# Altium project PCB_Project.PrjPCB
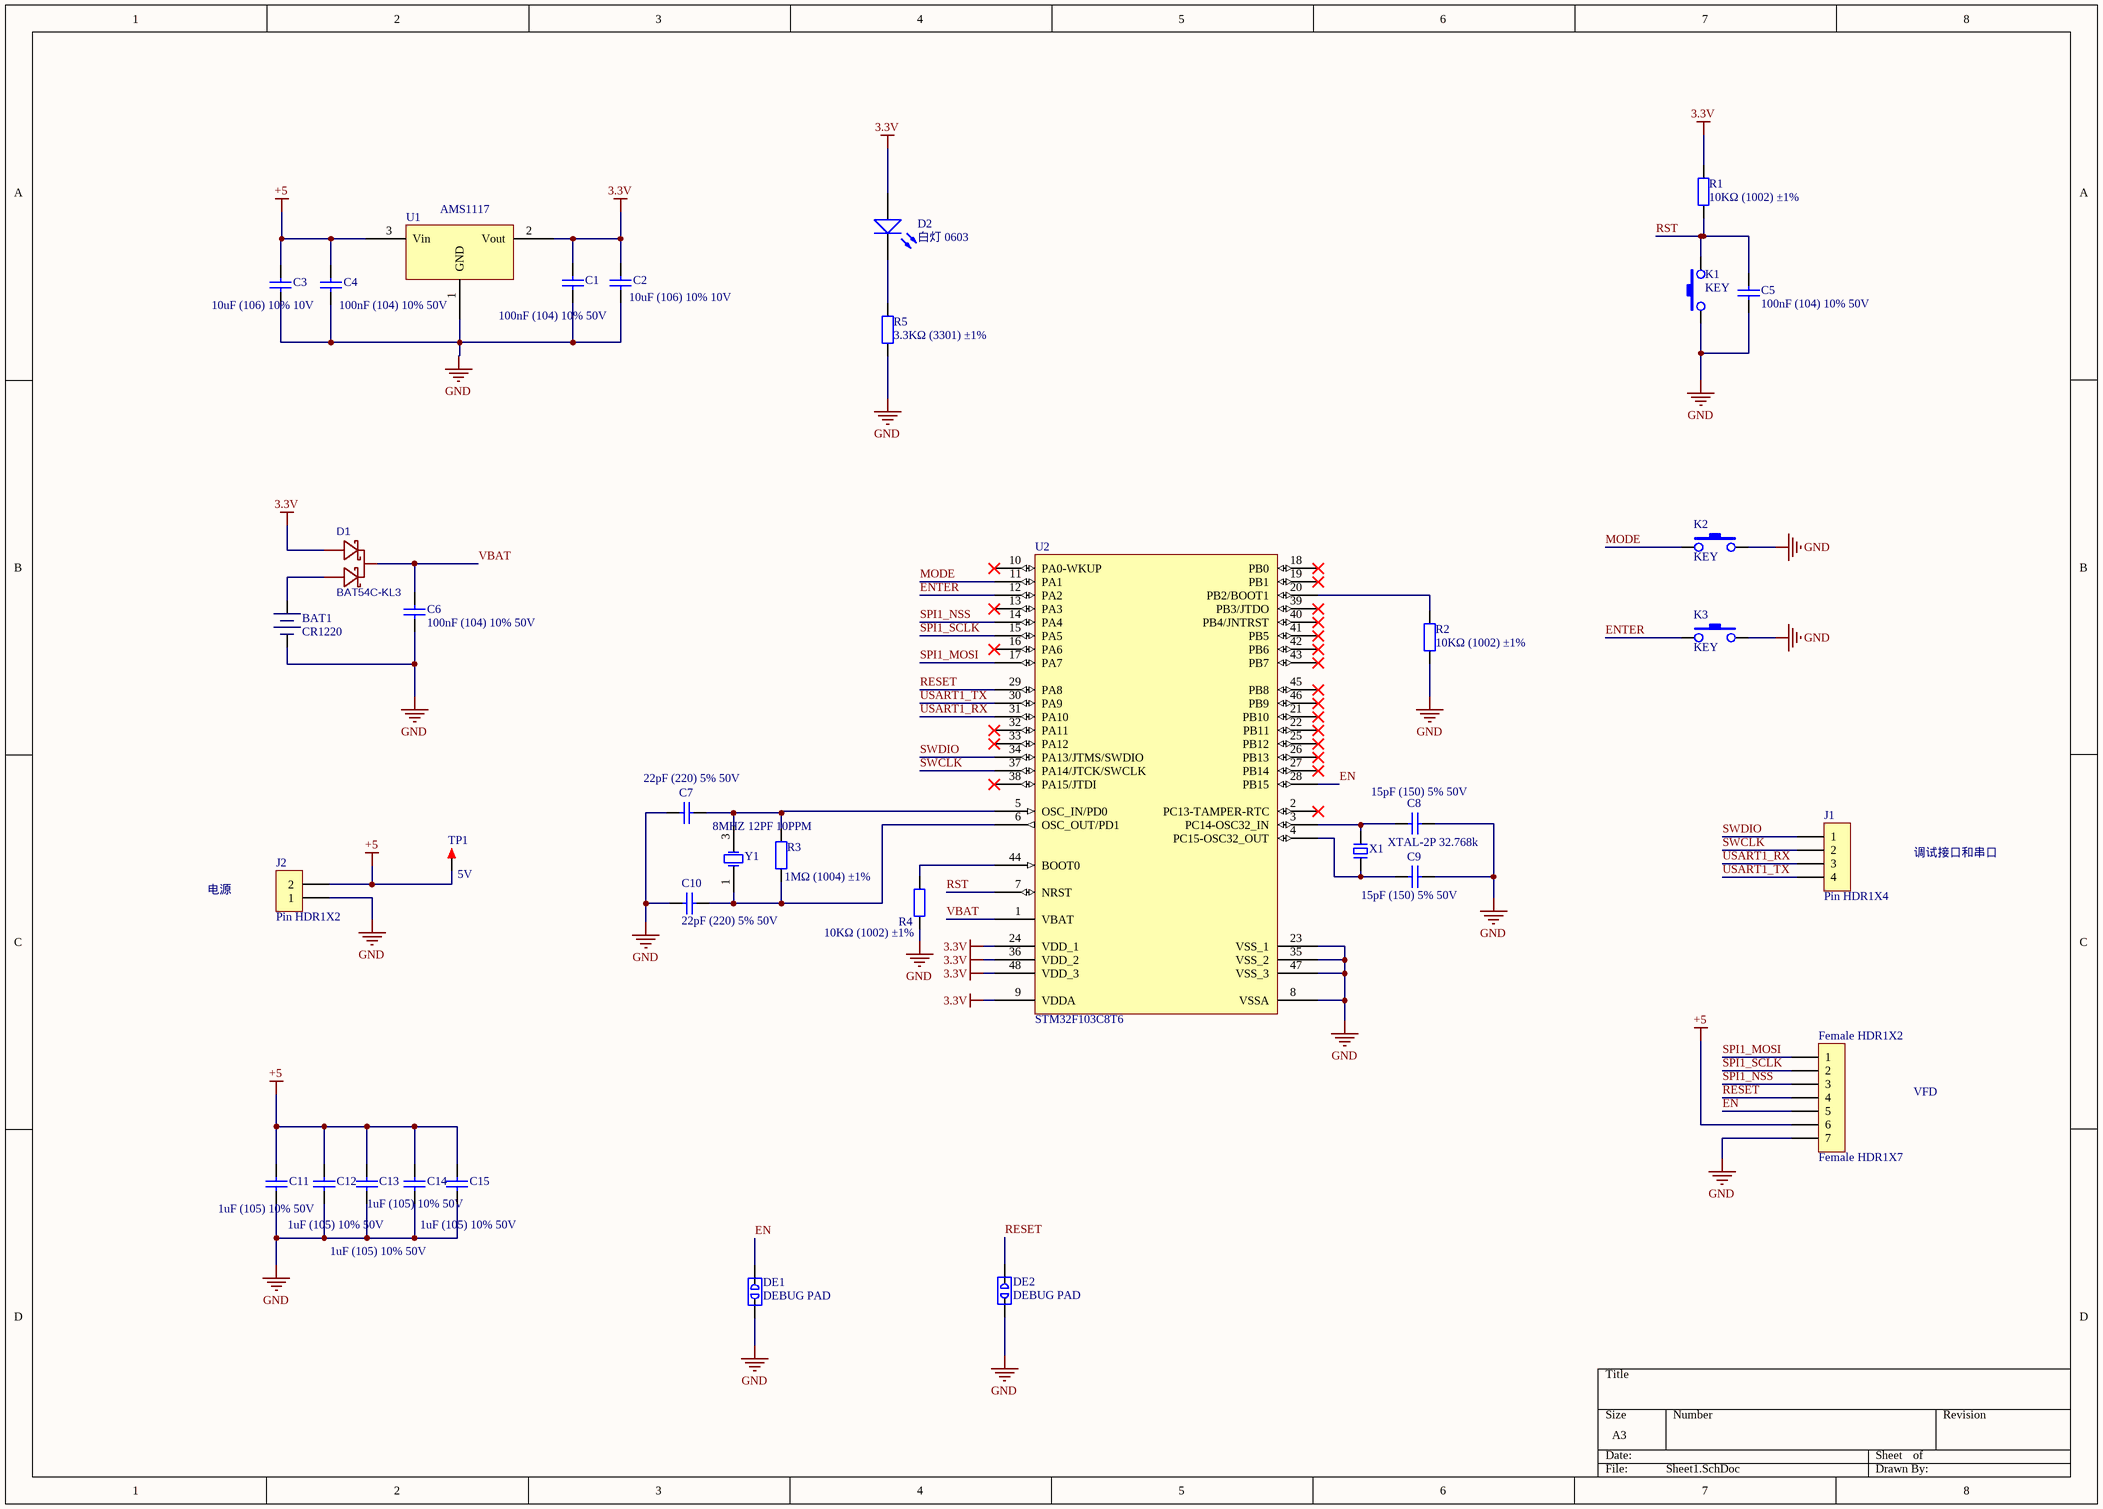
[diagram p0: Sheet1.SchDoc]
1 sheet, 36 parts. Net scope: global (net labels, ports and power ports of the same name join across sheets).
Board file: PCB1.PcbDoc

## Sheet Sheet1.SchDoc
size A3

### Parts
BAT1  CR1220  [CR1220-A]
C1  100nF (104) 10% 50V  [0603_C]
C2  10uF (106) 10% 10V  [0603_C]
C3  10uF (106) 10% 10V  [0603_C]
C4  100nF (104) 10% 50V  [0603_C]
C5  100nF (104) 10% 50V  [0603_C]
C6  100nF (104) 10% 50V  [0603_C]
C7  22pF (220) 5% 50V  [0603_C]
C8  15pF (150) 5% 50V  [0603_C]
C9  15pF (150) 5% 50V  [0603_C]
C10  22pF (220) 5% 50V  [0603_C]
C11  1uF (105) 10% 50V  [0603_C]
C12  1uF (105) 10% 50V  [0603_C]
C13  1uF (105) 10% 50V  [0603_C]
C14  1uF (105) 10% 50V  [0603_C]
C15  1uF (105) 10% 50V  [0603_C]
D1  BAT54C-KL3  [BAT54C_KL3]
D2  白灯 0603  [0603_LED_S1]
DE1  DEBUG PAD  [DEBUG_A]
DE2  DEBUG PAD  [DEBUG_A]
Female_HDR1X2  Female HDR1X7  [Fe-HDR1X7/2.54-S]
J1  Pin HDR1X4  [Pin HDR1X4/2.54mm-S]
J2  Pin HDR1X2  [Pin HDR1X2/2.54mm-S]
K1  KEY  [SMD-3X6X5]
K2  KEY  [SMD-3X6X5]
K3  KEY  [SMD-3X6X5]
R1  10KΩ (1002) ±1%  [0603_R]
R2  10KΩ (1002) ±1%  [0603_R]
R3  1MΩ (1004) ±1%  [0603_R]
R4  10KΩ (1002) ±1%  [0603_R]
R5  3.3KΩ (3301) ±1%  [0603_R]
TP1  5V  [TEST 1]
U1  AMS1117  [SOT223]
U2  STM32F103C8T6  [LQFP48 7X7]
X1  XTAL-2P 32.768k  [OSC 455E-LI]
Y1  8MHZ 12PF 10PPM  [SMD-3225_4P]

### Nets
3.3V: C1.2 C2.2 D1.1(A) D2.A R1.2 U1.2(Vout) U2.9(VDDA) U2.24(VDD_1) U2.36(VDD_2) U2.48(VDD_3)
+5: C3.2 C4.2 C11.2 C12.2 C13.2 C14.2 C15.2 Female_HDR1X2.6 J2.2 TP1.1 U1.3(Vin)
GND: BAT1.2 C1.1 C2.1 C3.1 C4.1 C5.1 C6.1 C7.1 C8.2 C9.2 C10.1 C11.1 C12.1 C13.1 C14.1 C15.1 DE1.1 DE2.1 Female_HDR1X2.7 J2.1 K1.1 K2.3 K3.3 R2.2 R4.1 R5.1 U1.1(GND) U2.8(VSSA) U2.23(VSS_1) U2.35(VSS_2) U2.47(VSS_3)
EN: DE1.2 Female_HDR1X2.5 U2.28(PB15)
ENTER: K3.1 U2.12(PA2)
MODE: K2.1 U2.11(PA1)
RESET: DE2.2 Female_HDR1X2.4 U2.29(PA8)
RST: C5.2 K1.3 R1.1 U2.7(NRST)
SPI1_MOSI: Female_HDR1X2.1 U2.17(PA7)
SPI1_NSS: Female_HDR1X2.3 U2.14(PA4)
SPI1_SCLK: Female_HDR1X2.2 U2.15(PA5)
SWCLK: J1.2 U2.37(PA14/JTCK/SWCLK)
SWDIO: J1.1 U2.34(PA13/JTMS/SWDIO)
USART1_RX: J1.3 U2.31(PA10)
USART1_TX: J1.4 U2.30(PA9)
VBAT: C6.2 D1.3(K) U2.1(VBAT)
NetBAT1_1: BAT1.1 D1.2(A)
NetC7_2: C7.2 R3.2 U2.5(OSC_IN/PD0) Y1.3(OSC2)
NetC8_1: C8.1 U2.3(PC14-OSC32_IN) X1.2
NetC9_1: C9.1 U2.4(PC15-OSC32_OUT) X1.1
NetC10_2: C10.2 R3.1 U2.6(OSC_OUT/PD1) Y1.1(OSC1)
NetD2_K: D2.K R5.2
NetR2_1: R2.1 U2.20(PB2/BOOT1)
NetR4_2: R4.2 U2.44(BOOT0)

Not connected (* = marked no-connect by the designer): U2 2(PC13-TAMPER-RTC)* 10(PA0-WKUP)* 13(PA3)* 16(PA6)* 18(PB0)* 19(PB1)* 21(PB10)* 22(PB11)* 25(PB12)* 26(PB13)* 27(PB14)* 32(PA11)* 33(PA12)* 38(PA15/JTDI)* 39(PB3/JTDO)* 40(PB4/JNTRST)* 41(PB5)* 42(PB6)* 43(PB7)* 45(PB8)* 46(PB9)*

### Notes on the sheet
- 调试接口和串口
- 电源
- VFD

### Library data of the parts
C1 C4-C6 = 0603 100nF (104) 10% 50V: 贴片电容; ComponentLink1Description: 供应商链接; ComponentLink1URL: http://www.szlcsc.com/product/details_15331.html; Package: 0603; Supplier: LC; SuppliersPartNumber: C14663
C2 C3 = 0603 10uF (106) 10% 10V: 贴片电容; ComponentLink1Description: 供应商链接; ComponentLink1URL: http://www.szlcsc.com/product/details_20411.html; Package: 0603; Supplier: LC; SuppliersPartNumber: C19702
C7 C10 = 0603 22pF (220) 5% 50V: 贴片电容; ComponentLink1Description: 供应商链接; ComponentLink1URL: http://www.szlcsc.com/product/details_2005.html; Package: 0603; Supplier: LC; SuppliersPartNumber: C1653
C8 C9 = 0603 15pF (150) 5% 50V: 贴片电容; ComponentLink1Description: 供应商链接; ComponentLink1URL: http://www.szlcsc.com/product/details_1996.html; Package: 0603; Supplier: LC; SuppliersPartNumber: C1644
C11-C15 = 0603 1uF (105) 10% 50V: 贴片电容; ComponentLink1Description: 供应商链接; ComponentLink1URL: http://www.szlcsc.com/product/details_16531.html; Package: 0603; Supplier: LC; SuppliersPartNumber: C15849
D1 = BAT54C-KL3: BOM_Manufacturer: ZRE; Contributor: LCSC; BOM_Supplier: LCSC; BOM_Supplier Part: C779698; BOM_Manufacturer Part: BAT54C-KL3; spicePre: D; spiceSymbolName: BAT54C-KL3
D2 = 0603 白灯: 发光二极管; ComponentLink1Description: 供应商链接; ComponentLink1URL: http://www.szlcsc.com/product/details_2663.html; Package: 0603; Supplier: LC; SuppliersPartNumber: C2290
DE1 DE2 = DEBUG: 调试断点焊盘; 版权归属: 源创客; BOM名称: 调试断点焊盘; 学习资源: www.ooocke.com
R1 R2 R4 = 0603 10KΩ (1002) 1%: 贴片电阻; ComponentLink1Description: 供应商链接; ComponentLink1URL: http://www.szlcsc.com/product/details_26547.html; Package: 0603; Supplier: LC; SuppliersPartNumber: C25804
R3 = 0603 1MΩ (1004) 1%: 贴片电阻; ComponentLink1Description: 供应商链接; ComponentLink1URL: http://www.szlcsc.com/product/details_23662.html; Package: 0603; Supplier: LC; SuppliersPartNumber: C22935
R5 = 0603 3.3KΩ (3301) 1%: 贴片电阻; ComponentLink1Description: 供应商链接; ComponentLink1URL: http://www.szlcsc.com/product/details_23705.html; Package: 0603; Supplier: LC; SuppliersPartNumber: C22978
TP1 = TEST: 测试点; 版权归属: 源创客; BOM名称: 测试点; 学习资源: www.ooocke.com
U1 = AMS1117: 三端稳压芯片
X1 = XTAL-2P: 2脚无源脚晶振
Y1 = SMD-3225_4P  25MHZ 12PF 10PPM: 贴片晶振; ComponentLink1Description: 供应商链接; ComponentLink1URL: http://www.szlcsc.com/product/details_9526.html; Package: SMD-3225_4P; Supplier: LC; SuppliersPartNumber: C9006